# EAGLE design transmitter (EAGLE 9.6.2)
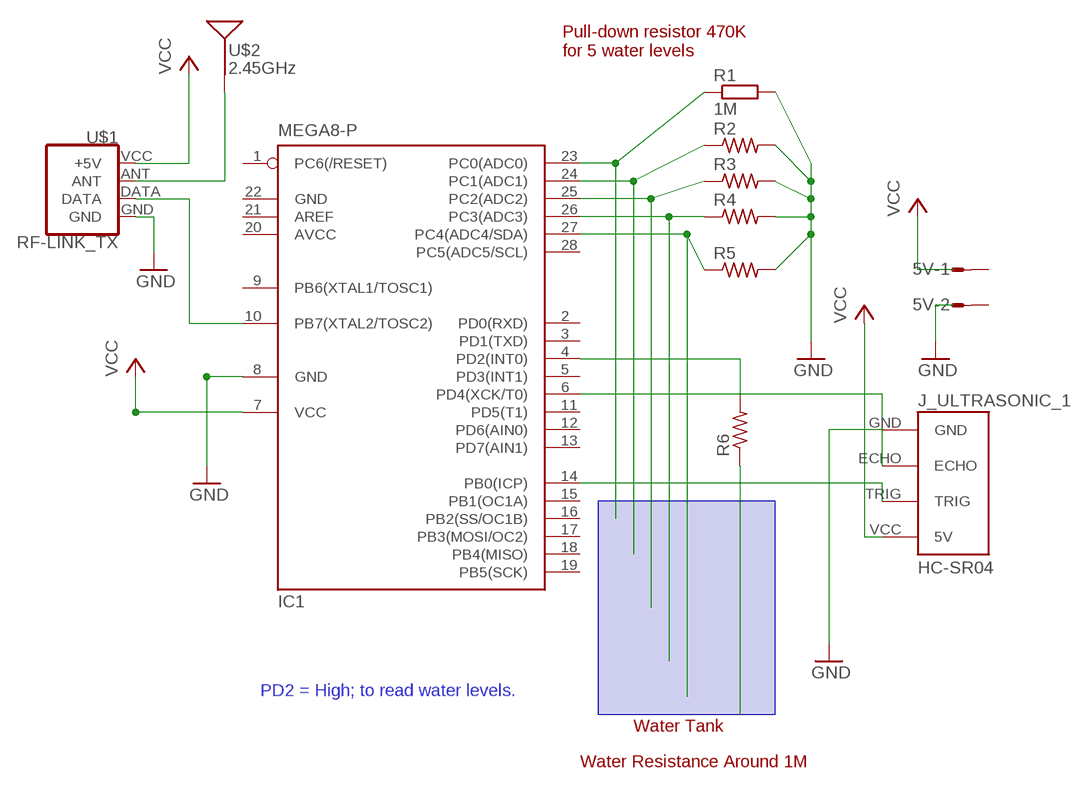
[diagram p0: schematic, sheet 1]

## Parts
5V  S02P  [S02P]
IC1  MEGA8-P  [DIL28-3]
J_ULTRASONIC_1  HC-SR04  [HC-SR04_FOOTPRINT]
R1  1M  R-EU_0204/7  [0204/7]
R2  R-US_0204/2V  [0204V]
R3  R-US_0204/2V  [0204V]
R4  R-US_0204/2V  [0204V]
R5  R-US_0204/2V  [0204V]
R6  R-US_0204/2V  [0204V]
U$1  RF-LINK_TX  [RF-LINK_TX]
U$2  2.45GHz  ANTENNA2.4GHZ-6.5X2.2MM  [ANT-2.4GHZ-6.5X2.2MM]

## Nets
GND: IC1.8(GND) J_ULTRASONIC_1.GND R1.2 R2.2 R3.2 R4.2 R5.2 U$1.GND
N$1: IC1.23(PC0(ADC0)) R1.1
N$2: IC1.26(PC3(ADC3)) R4.1
N$3: IC1.25(PC2(ADC2)) R3.1
N$4: IC1.24(PC1(ADC1)) R2.1
N$5: IC1.27(PC4(ADC4/SDA)) R5.1
N$6: IC1.10(PB7(XTAL2/TOSC2)) U$1.DATA
N$7: U$1.ANT U$2.FEED(SIGNAL)
N$8: R6.1
N$9: IC1.4(PD2(INT0)) R6.2
N$10: IC1.6(PD4(XCK/T0)) J_ULTRASONIC_1.ECHO
N$11: IC1.14(PB0(ICP)) J_ULTRASONIC_1.TRIG
VCC: IC1.7(VCC) J_ULTRASONIC_1.VCC(5V) U$1.VCC(+5V)
Unconnected: 5V.1 5V.2 IC1.1(PC6(/RESET)) IC1.2(PD0(RXD)) IC1.3(PD1(TXD)) IC1.5(PD3(INT1)) IC1.9(PB6(XTAL1/TOSC1)) IC1.11(PD5(T1)) IC1.12(PD6(AIN0)) IC1.13(PD7(AIN1)) IC1.15(PB1(OC1A)) IC1.16(PB2(SS/OC1B)) IC1.17(PB3(MOSI/OC2)) IC1.18(PB4(MISO)) IC1.19(PB5(SCK)) IC1.21(AREF) IC1.28(PC5(ADC5/SCL))

## Notes on the sheet
- Pull-down resistor 470K 
  for 5 water levels
- PD2 = High; to read water levels.
- Water Tank
- Water Resistance Around 1M

## Power pins joined to a net without a drawn wire
AVCC: IC1.20(AVCC)
GND: IC1.22(GND)

## Library data of the parts
5V = con-amp-mt:S02P: AMP MT CONNECTOR; OC_FARNELL: unknown; OC_NEWARK: unknown
IC1 = atmel:MEGA8-P: MICROCONTROLLER 8 Kbytes FLASH, 1 kbytes SRAM, 512 bytes EEPROM, USART, 4-channel 10 bit ADC, 2-channel 8 bit ADC Pin compatible with Atmega48, ATMega88, ATMega168 Source: avr.lbr; OC_FARNELL: unknown; OC_NEWARK: unknown
J_ULTRASONIC_1 = Ultrasonic Sensor HC-SR04:HC-SR04: Ultrasonic Sensor HC-SR04
R1 = rcl:R-EU_: RESISTOR, European symbol; SPICEPREFIX: R
R2-R6 = rcl:R-US_: RESISTOR, American symbol; SPICEPREFIX: R
U$1 = SparkFun-RF:RF-LINK_TX: RF Link Transmitter (434 MHz, 315 MHz) These wireless transmitters work with equivalent receivers. They can easily fit into a breadboard and work well with microcontrollers to create a very simple wireless data link. Since these are only transmitters, they will only work communicating data one-way, you would need two pairs (of different frequencies) to act as a transmitter/receiver pair. SparkFun Products RF Link Transmitter - 434MHz <https://www.sparkfun.com/products/10534> (WRL-10534); SF_ID: WRL-10534
U$2 = SparkFun-RF:ANTENNA: Single-ended Antennae 2.4GHz and antennae with just one terminal. These are all chip antennae. 2.4GHz (WiFi/BT/ZigBee) Antennae ANT-2.4GHZ-6.5X2.2MM - 6.5 x 2.2 mm chip antenna. (SparkFun Product <https://www.sparkfun.com/products/144>) ANT-2.4GHZ8.0X1.0MM - 8.0 x 1.0 mm chip antenna. (Datasheet <http://www.mouser.com/ds/2/611/antenna_2500at44m0400-242425.pdf>) ANT-2.4GHZ9.5X2.0MM - 9.5 x 2.0 mm chip antenna. (SparkFun Product <https://www.sparkfun.com/products/9025>); PROD_ID: ANT-08187; SF_ID: WRL-00144

## Board
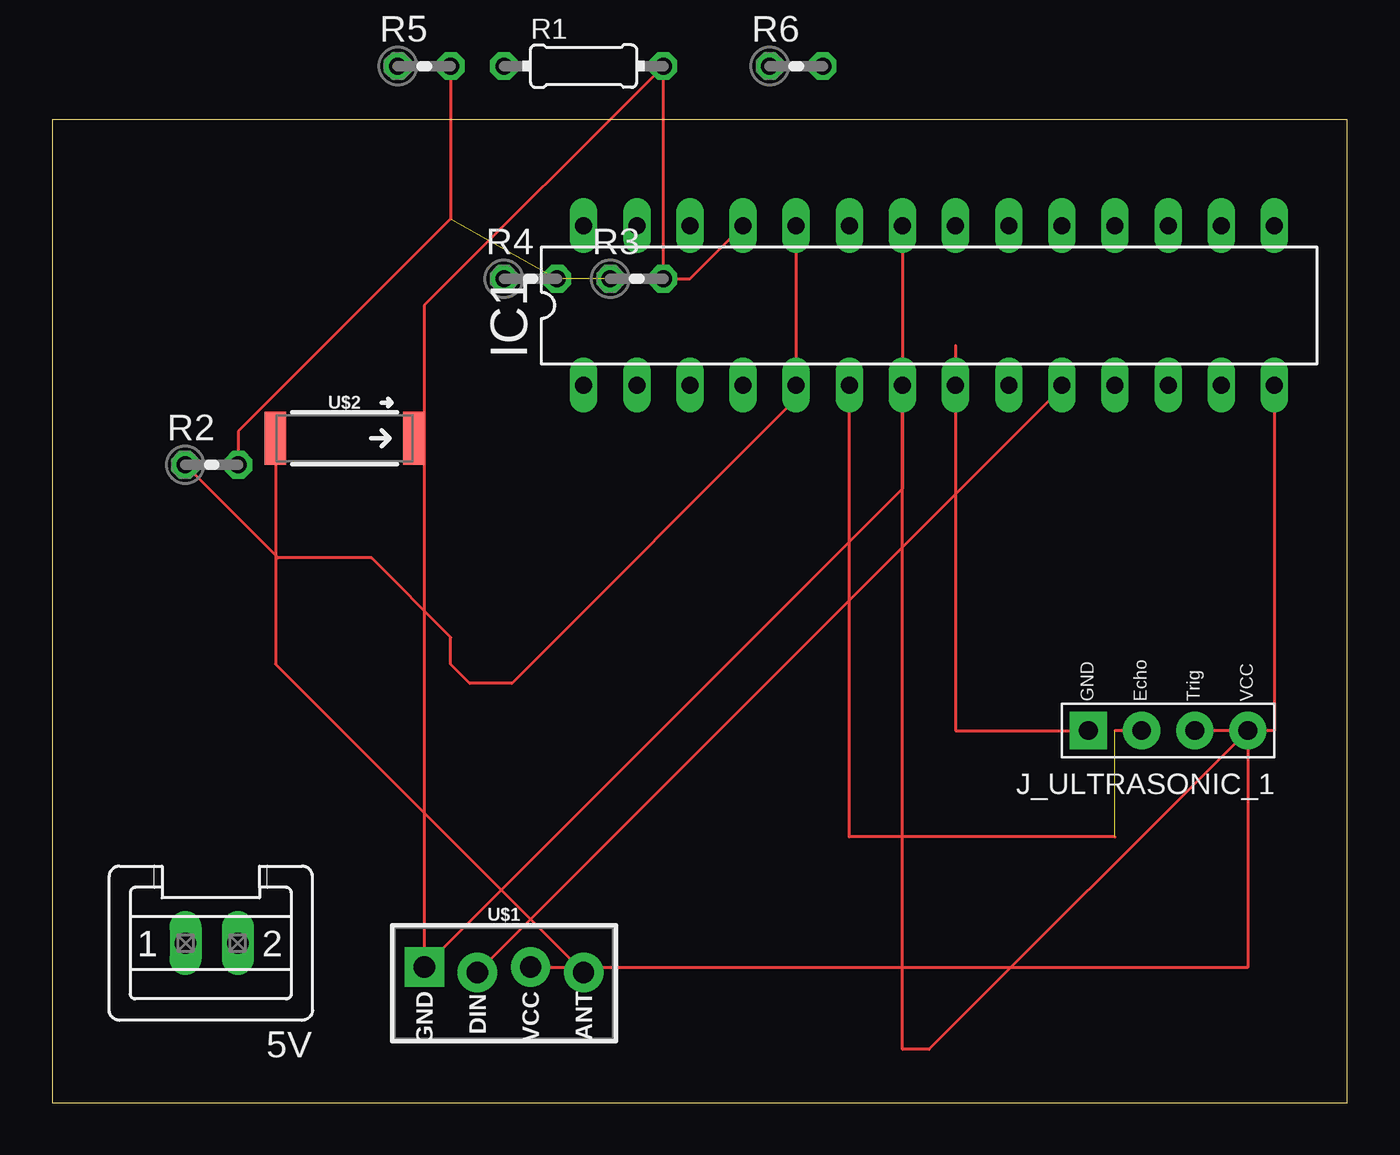
[diagram p1: board, top side]
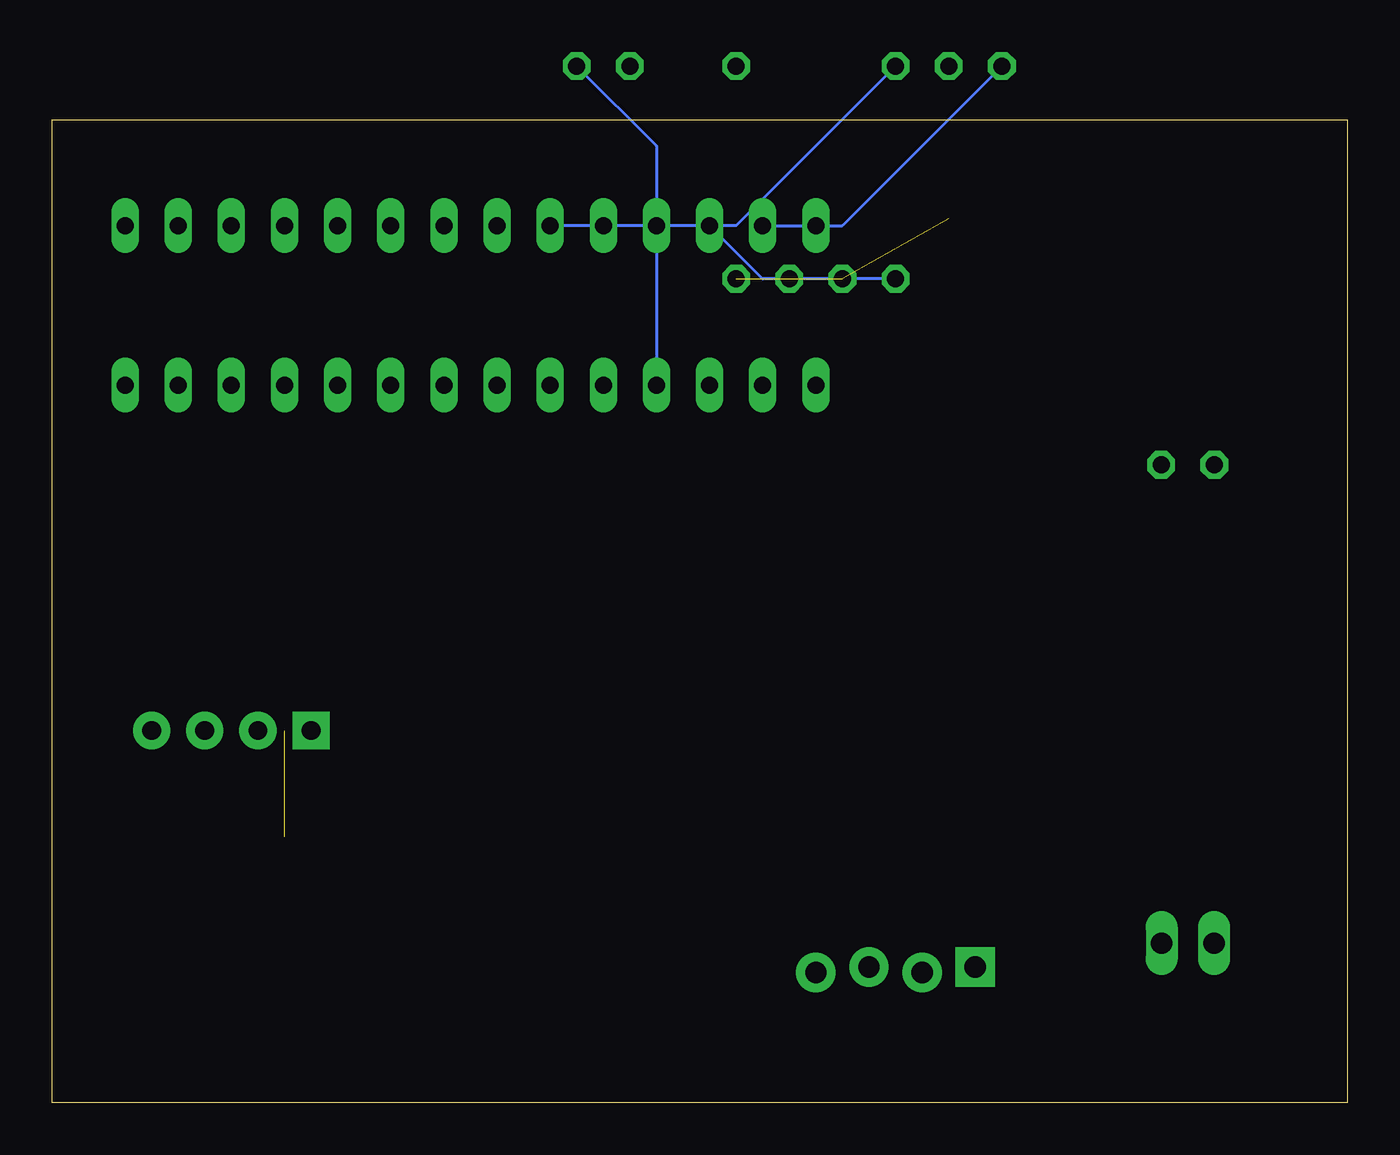
[diagram p2: board, bottom side, seen from below]

Size 61.9 x 46.98 mm. Coordinates in mm from the lower left corner, seen from the top.
Outline: 0,0 61.9,0 61.9,46.98 0,46.98 0,0
Copper layers (1*16): Top 0.035mm / dielectric 1.5mm / Bottom 0.035mm
Design rules "default": minimum track width 6mil, minimum drill 0.35mm, track to track 6mil, track to pad 6mil, pad to pad 6mil, via to via 6mil, smd to smd 6mil, copper to edge 40mil, drill to drill 6mil, minimum pad ring 10mil, minimum via ring 8mil, stop-mask expansion 4mil, vias tented up to drill 0mil, thermal gap 10mil

### Footprints (pad centres in the part's own frame; a part is rotated, then mirrored left to right if it is on the bottom)
S02P = drill 1.016 long: 1 1.25,0; 2 -1.25,0
DIL28-3 = drill 0.813 long: 1 -16.51,-3.81; 2 -13.97,-3.81; 3 -11.43,-3.81; 4 -8.89,-3.81; 5 -6.35,-3.81; 6 -3.81,-3.81; 7 -1.27,-3.81; 8 1.27,-3.81; 9 3.81,-3.81; 10 6.35,-3.81; 11 8.89,-3.81; 12 11.43,-3.81; 13 13.97,-3.81; 14 16.51,-3.81; 15 16.51,3.81; 16 13.97,3.81; 17 11.43,3.81; 18 8.89,3.81; 19 6.35,3.81; 20 3.81,3.81; 21 1.27,3.81; 22 -1.27,3.81; 23 -3.81,3.81; 24 -6.35,3.81; 25 -8.89,3.81; 26 -11.43,3.81; 27 -13.97,3.81; 28 -16.51,3.81
HC-SR04_FOOTPRINT = drill 0.9 pad 1.778: ECHO 0,1.27; TRIG 0,-1.27; VCC 0,-3.81 | drill 0.9 pad 1.778 square: GND 0,3.81
0204/7 = drill 0.813 octagon: 1 -3.81,0; 2 3.81,0
0204V = drill 0.813 octagon: 1 -1.27,0; 2 1.27,0
RF-LINK_TX = drill 1.016 pad 1.88: ANT 3.81,-0.127; DATA -1.27,-0.127; VCC 1.27,0.127 | drill 1.016 pad 1.88 square: GND -3.81,0.127
ANT-2.4GHZ-6.5X2.2MM = smd 1.016 x 2.54: FEED -3.302,0; NC 3.302,0

### Placement (x,y rotation side)
5V  7.62,7.62 180 top
IC1  41.91,38.1 0 top
J_ULTRASONIC_1  53.34,17.78 90 top
R1  25.4,49.53 0 top
R2  7.62,30.48 0 top
R3  27.94,39.37 0 top
R4  22.86,39.37 0 top
R5  17.78,49.53 0 top
R6  35.56,49.53 0 top
U$1  21.59,6.35 0 top
U$2  13.97,31.75 0 top

### Tracks (layer width: path | path; a pad name or v marks a point on that pad's centre or on a via)
GND  (2 unrouted)
  Top 0.152: J_ULTRASONIC_1.GND 43.18,17.78 IC1.8 43.18,36.17 | R3.2 R1.2 17.78,38.1 U$1.GND 40.64,29.34 IC1.22 40.64,38.71 | R5.2 19.05,42.23 8.89,32.07 R2.2
N$1
  Bottom 0.152: R1.1 29.21,41.91 IC1.23
N$2
  Bottom 0.152: R4.1 27.94,39.37 IC1.26
N$3
  Top 0.152: IC1.25 30.48,39.37 R3.1
N$4
  Top 0.152: IC1.24 35.56,33.63 21.97,20.04 19.95,20.04 19.05,20.94 19.05,22.24 15.25,26.03 10.8,26.03 R2.1
N$5
  Bottom 0.152: R5.1 24.13,41.91 IC1.27
N$6
  Top 0.152: IC1.10 48.32,34.23 U$1.DATA
N$7
  Top 0.152: U$1.ANT 10.67,20.95 U$2.FEED
N$9
  Bottom 0.152: R6.2 33.02,45.72 IC1.4
N$10  (1 unrouted)
  Top 0.152: IC1.6 38.1,12.7 50.8,12.7 | J_ULTRASONIC_1.ECHO 50.8,17.78
N$11
  Top 0.152: IC1.14 58.42,17.78 J_ULTRASONIC_1.TRIG
VCC
  Top 0.152: IC1.7 40.64,2.54 41.91,2.54 J_ULTRASONIC_1.VCC 57.15,6.48 U$1.VCC